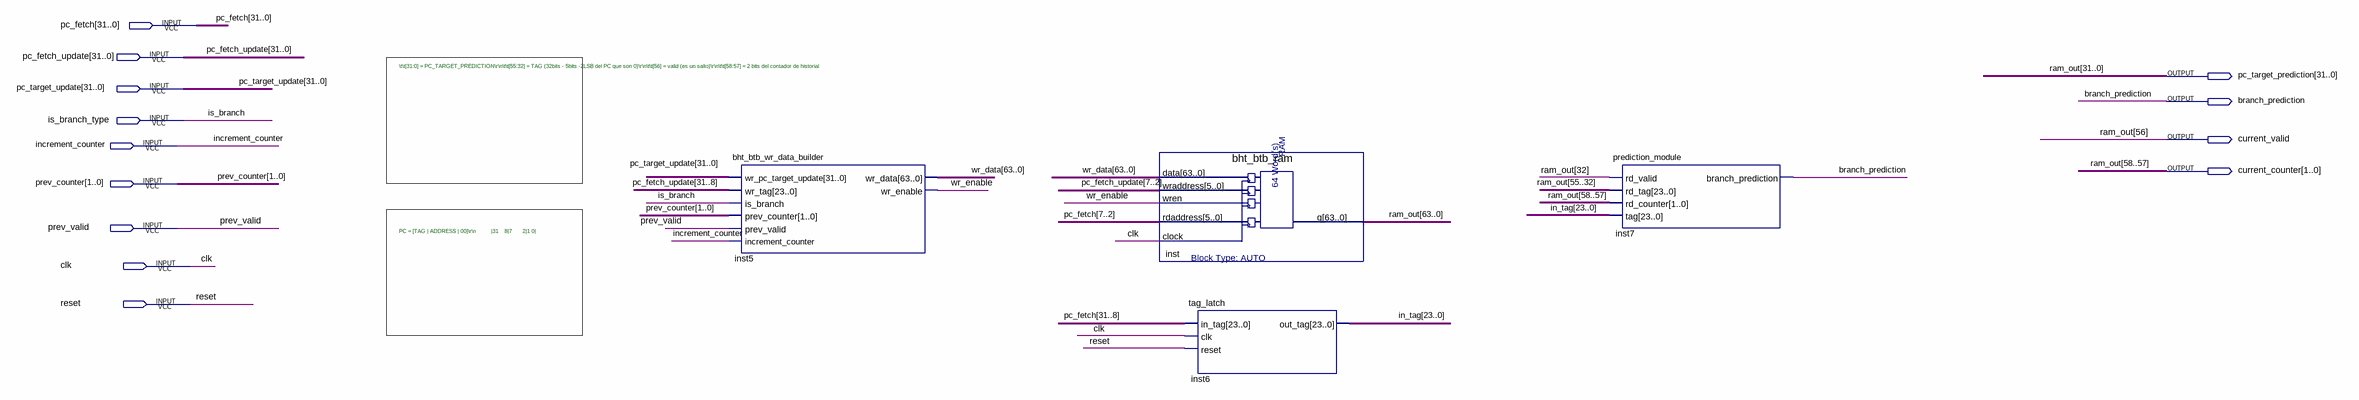
[diagram p0: schematic sheet]
// Quartus schematic bht_btb_module.bdf as structural Verilog: 4 symbols, 13 pins
module bht_btb_module (
  input  [31:0] pc_fetch,
  input  [31:0] pc_fetch_update,
  input  [31:0] pc_target_update,
  input  is_branch_type,
  input  increment_counter,
  input  [1:0] prev_counter,
  input  prev_valid,
  input  clk,
  input  reset,
  output [31:0] pc_target_prediction,
  output branch_prediction,
  output current_valid,
  output [1:0] current_counter
);

  wire wr_enable;
  wire [23:0] in_tag;
  wire [63:0] wr_data;
  wire [63:32] ram_out;

  bht_btb_wr_data_builder inst5 (
    .wr_pc_target_update(pc_target_update), .wr_tag(pc_fetch_update[31:8]), .is_branch(is_branch_type),
    .prev_counter(prev_counter), .prev_valid(prev_valid), .increment_counter(increment_counter),
    .wr_data(wr_data), .wr_enable(wr_enable));
  bht_btb_ram inst (
    .data(wr_data), .wraddress(pc_fetch_update[7:2]), .wren(wr_enable), .rdaddress(pc_fetch[7:2]),
    .clock(clk), .q({ram_out[63:59], current_counter, current_valid, ram_out[55:32], pc_target_prediction}));
  tag_latch inst6 (.in_tag(pc_fetch[31:8]), .clk(clk), .reset(reset), .out_tag(in_tag));
  prediction_module inst7 (
    .rd_valid(ram_out[32]), .rd_tag(ram_out[55:32]), .rd_counter(current_counter), .tag(in_tag),
    .branch_prediction(branch_prediction));

  // Other names for the same wires on the sheet: is_branch = is_branch_type;
  //   ram_out (some bits) = {current_counter, current_valid, pc_target_prediction}

  // Notes on the sheet:
  //   \t\t[31:0] = PC_TARGET_PREDICTION\r\n\t\t[55:32] = TAG (32bits - 5bits -2LSB del PC que son 0)\r\n\t\t[56] = valid (es un salto)\r\n\t\t[58:57] = 2 bits del contador de historial
  //   PC = [TAG | ADDRESS | 00]\r\n          |31    8|7       2|1 0|
endmodule
